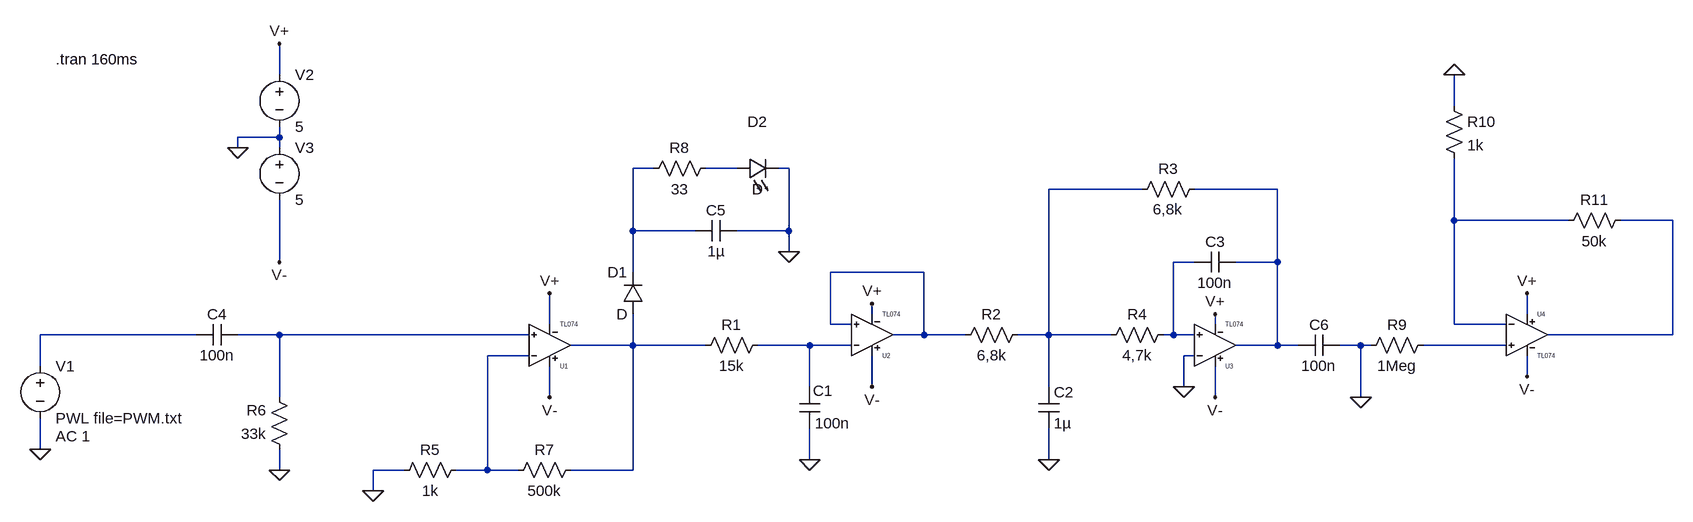
[diagram p0: schematic Empfangsseite.asc]
Empfangsseite.asc, the LTspice schematic file:
Version 4
SHEET 1 1944 680
WIRE -304 -336 -304 -384
WIRE 1504 -288 1504 -336
WIRE -304 -240 -304 -256
WIRE -304 -240 -368 -240
WIRE -368 -224 -368 -240
WIRE -304 -224 -304 -240
WIRE 272 -192 240 -192
WIRE 400 -192 352 -192
WIRE 480 -192 464 -192
WIRE 1024 -160 880 -160
WIRE 1232 -160 1104 -160
WIRE 1504 -112 1504 -208
WIRE 1680 -112 1504 -112
WIRE 1840 -112 1760 -112
WIRE 240 -96 240 -192
WIRE 336 -96 240 -96
WIRE 480 -96 480 -192
WIRE 480 -96 400 -96
WIRE 480 -64 480 -96
WIRE -304 -48 -304 -144
WIRE 1104 -48 1072 -48
WIRE 1232 -48 1232 -160
WIRE 1232 -48 1168 -48
WIRE 240 -32 240 -96
WIRE 688 -32 544 -32
WIRE 608 32 608 16
WIRE 1616 32 1616 0
WIRE 112 48 112 0
WIRE 544 48 544 -32
WIRE 576 48 544 48
WIRE 1136 48 1136 32
WIRE 1504 48 1504 -112
WIRE 1584 48 1504 48
WIRE -432 64 -672 64
WIRE -304 64 -368 64
WIRE 80 64 -304 64
WIRE 688 64 688 -32
WIRE 688 64 640 64
WIRE 752 64 688 64
WIRE 880 64 880 -160
WIRE 880 64 832 64
WIRE 976 64 880 64
WIRE 1072 64 1072 -48
WIRE 1072 64 1056 64
WIRE 1104 64 1072 64
WIRE 1840 64 1840 -112
WIRE 1840 64 1648 64
WIRE 240 80 240 32
WIRE 240 80 144 80
WIRE 352 80 240 80
WIRE 512 80 432 80
WIRE 576 80 512 80
WIRE 1232 80 1232 -48
WIRE 1232 80 1168 80
WIRE 1264 80 1232 80
WIRE 1360 80 1328 80
WIRE 1376 80 1360 80
WIRE 1584 80 1456 80
WIRE 80 96 16 96
WIRE 1104 96 1088 96
WIRE -672 112 -672 64
WIRE 1616 128 1616 96
WIRE 512 144 512 80
WIRE 608 144 608 96
WIRE 880 144 880 64
WIRE 1088 144 1088 96
WIRE -304 160 -304 64
WIRE 112 160 112 112
WIRE 1136 160 1136 112
WIRE 1360 160 1360 80
WIRE -672 240 -672 192
WIRE 512 256 512 208
WIRE 880 256 880 208
WIRE -304 272 -304 240
WIRE -112 272 -160 272
WIRE 16 272 16 96
WIRE 16 272 -32 272
WIRE 64 272 16 272
WIRE 240 272 240 80
WIRE 240 272 144 272
WIRE -160 304 -160 272
FLAG 512 256 0
FLAG 880 256 0
FLAG 1088 144 0
FLAG -672 240 0
FLAG -304 -384 V+
FLAG 608 16 V+
FLAG 1136 32 V+
FLAG 1136 160 V-
FLAG 608 144 V-
FLAG -304 -48 V-
FLAG -368 -224 0
FLAG 112 0 V+
FLAG 112 160 V-
FLAG -304 272 0
FLAG -160 304 0
FLAG 480 -64 0
FLAG 1360 160 0
FLAG 1616 0 V+
FLAG 1616 128 V-
FLAG 1504 -336 0
SYMBOL cap 496 144 R0
WINDOW 0 21 6 Left 2
SYMATTR InstName C1
SYMATTR Value 100n
SYMBOL cap 864 144 R0
SYMATTR InstName C2
SYMATTR Value 1µ
SYMBOL cap 1168 -64 R90
WINDOW 0 0 32 VBottom 2
WINDOW 3 32 32 VTop 2
SYMATTR InstName C3
SYMATTR Value 100n
SYMBOL res 448 64 R90
WINDOW 0 0 56 VBottom 2
WINDOW 3 32 56 VTop 2
SYMATTR InstName R1
SYMATTR Value 15k
SYMBOL res 848 48 R90
WINDOW 0 0 56 VBottom 2
WINDOW 3 32 56 VTop 2
SYMATTR InstName R2
SYMATTR Value 6,8k
SYMBOL res 1120 -176 R90
WINDOW 0 0 56 VBottom 2
WINDOW 3 31 57 VTop 2
SYMATTR InstName R3
SYMATTR Value 6,8k
SYMBOL res 1072 48 R90
WINDOW 0 0 56 VBottom 2
WINDOW 3 32 56 VTop 2
SYMATTR InstName R4
SYMATTR Value 4,7k
SYMBOL voltage -672 96 R0
WINDOW 123 24 124 Left 2
WINDOW 39 0 0 Left 2
SYMATTR Value2 AC 1
SYMATTR InstName V1
SYMATTR Value PWL file=PWM.txt
SYMBOL voltage -304 -352 R0
WINDOW 123 0 0 Left 2
WINDOW 39 0 0 Left 2
SYMATTR InstName V2
SYMATTR Value 5
SYMBOL voltage -304 -240 R0
WINDOW 123 0 0 Left 2
WINDOW 39 0 0 Left 2
SYMATTR InstName V3
SYMATTR Value 5
SYMBOL TL074 608 128 M180
SYMATTR InstName U2
SYMBOL res -288 256 R180
WINDOW 0 36 76 Left 2
WINDOW 3 36 40 Left 2
SYMATTR InstName R6
SYMATTR Value 33k
SYMBOL cap -368 48 R90
WINDOW 0 0 32 VBottom 2
WINDOW 3 32 32 VTop 2
SYMATTR InstName C4
SYMATTR Value 100n
SYMBOL res -16 256 R90
WINDOW 0 0 56 VBottom 2
WINDOW 3 32 56 VTop 2
SYMATTR InstName R5
SYMATTR Value 1k
SYMBOL res 160 256 R90
WINDOW 0 0 56 VBottom 2
WINDOW 3 32 56 VTop 2
SYMATTR InstName R7
SYMATTR Value 500k
SYMBOL diode 256 32 R180
WINDOW 0 24 64 Left 2
WINDOW 3 24 0 Left 2
SYMATTR InstName D1
SYMBOL LED 400 -176 R270
WINDOW 0 72 32 VTop 2
WINDOW 3 0 32 VBottom 2
SYMATTR InstName D2
SYMBOL res 368 -208 R90
WINDOW 0 0 56 VBottom 2
WINDOW 3 32 56 VTop 2
SYMATTR InstName R8
SYMATTR Value 33
SYMBOL cap 400 -112 R90
WINDOW 0 0 32 VBottom 2
WINDOW 3 32 32 VTop 2
SYMATTR InstName C5
SYMATTR Value 1µ
SYMBOL cap 1328 64 R90
WINDOW 0 0 32 VBottom 2
WINDOW 3 32 32 VTop 2
SYMATTR InstName C6
SYMATTR Value 100n
SYMBOL res 1472 64 R90
WINDOW 0 0 56 VBottom 2
WINDOW 3 32 56 VTop 2
SYMATTR InstName R9
SYMATTR Value 1Meg
SYMBOL res 1488 -304 R0
SYMATTR InstName R10
SYMATTR Value 1k
SYMBOL res 1664 -96 R270
WINDOW 0 32 56 VTop 2
WINDOW 3 0 56 VBottom 2
SYMATTR InstName R11
SYMATTR Value 50k
SYMBOL TL074 112 144 M180
SYMATTR InstName U1
SYMBOL TL074 1136 144 M180
SYMATTR InstName U3
SYMBOL TL074 1616 0 R0
SYMATTR InstName U4
TEXT -648 -360 Left 2 !.tran 160ms

The netlist it stands for:
* Empfangsseite.asc
C1 N012 0 100n
C2 N003 0 1µ
C3 N004 N007 100n
R1 N012 N011 15k
R2 N003 N008 6,8k
R3 N004 N003 6,8k
R4 N007 N003 4,7k
V1 N009 0 PWL file=PWM.txt AC 1
V2 V+ 0 5
V3 0 V- 5
XU2 N008 N012 V- V+ N008 TL074  ; pins In+ In- V+ V- OUT
R6 0 N010 33k
C4 N010 N009 100n
R5 N014 0 1k
R7 N011 N014 500k
D1 N011 N001 D
D2 N002 0 D
R8 N002 N001 33
C5 0 N001 1µ
C6 0 N004 100n
R9 N013 0 1Meg
R10 0 N005 1k
R11 N005 N006 50k
XU1 N010 N014 V- V+ N011 TL074  ; pins In+ In- V+ V- OUT
XU3 N007 0 V- V+ N004 TL074  ; pins In+ In- V+ V- OUT
XU4 N013 N005 V+ V- N006 TL074  ; pins In+ In- V+ V- OUT
.model D D
.lib standard.dio
.tran 160ms
.lib OWN.lib
.backanno
.end